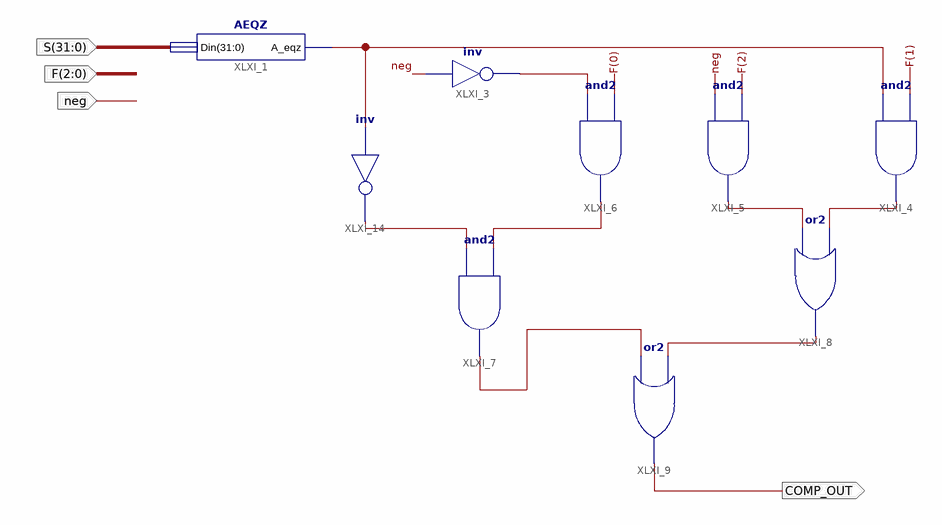
[diagram p0: schematic sheet 1]
// Xilinx ISE schematic Comparator32.sch (spartan6) as structural Verilog: 9 symbols, 4 ports
module Comparator32 (
  input  [31:0] S,
  input  [2:0] F,
  input  neg,
  output COMP_OUT
);

  wire XLXN_12, XLXN_15, XLXN_23, XLXN_24, XLXN_44, XLXN_45, XLXN_48, XLXN_49;

  AEQZ XLXI_1 (.Din(S), .A_eqz(XLXN_12));
  or XLXI_8 (XLXN_48, XLXN_45, XLXN_15);
  or XLXI_9 (COMP_OUT, XLXN_49, XLXN_48);
  not XLXI_14 (XLXN_44, XLXN_12);
  and XLXI_5 (XLXN_45, neg, F[2]);
  and XLXI_4 (XLXN_15, XLXN_12, F[1]);
  not XLXI_3 (XLXN_23, neg);
  and XLXI_6 (XLXN_24, XLXN_23, F[0]);
  and XLXI_7 (XLXN_49, XLXN_44, XLXN_24);
endmodule
